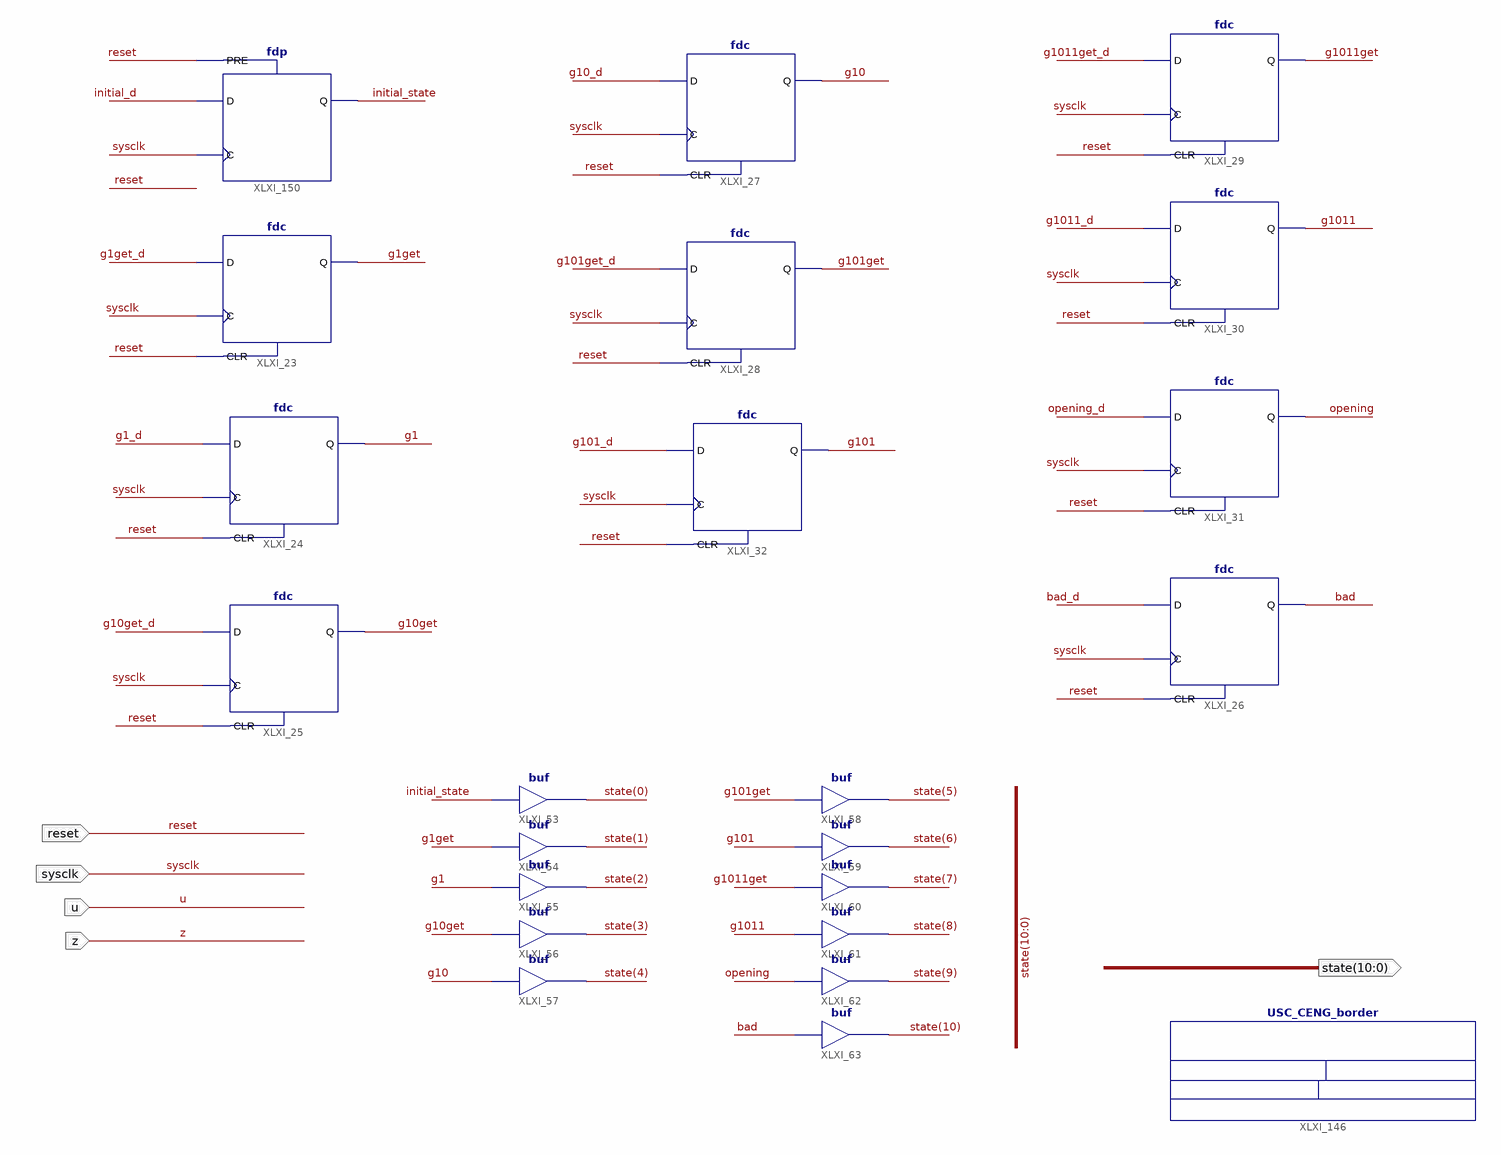
[diagram p0: schematic sheet 1]
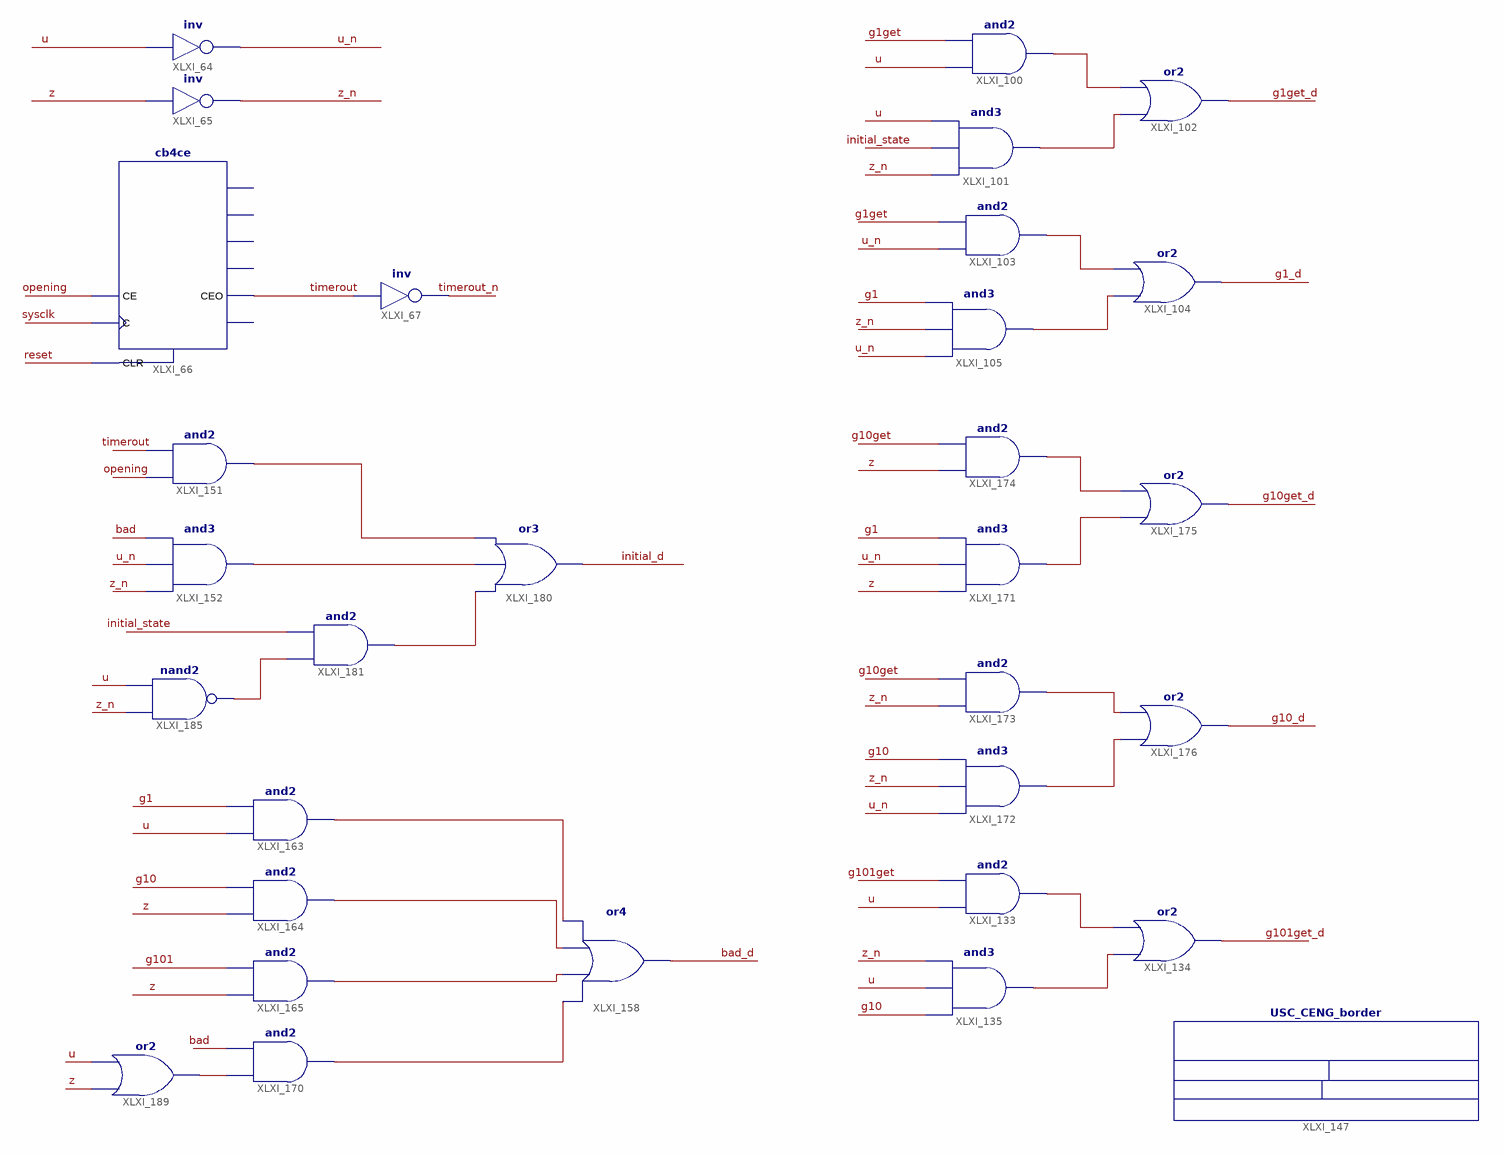
[diagram p1: schematic sheet 2]
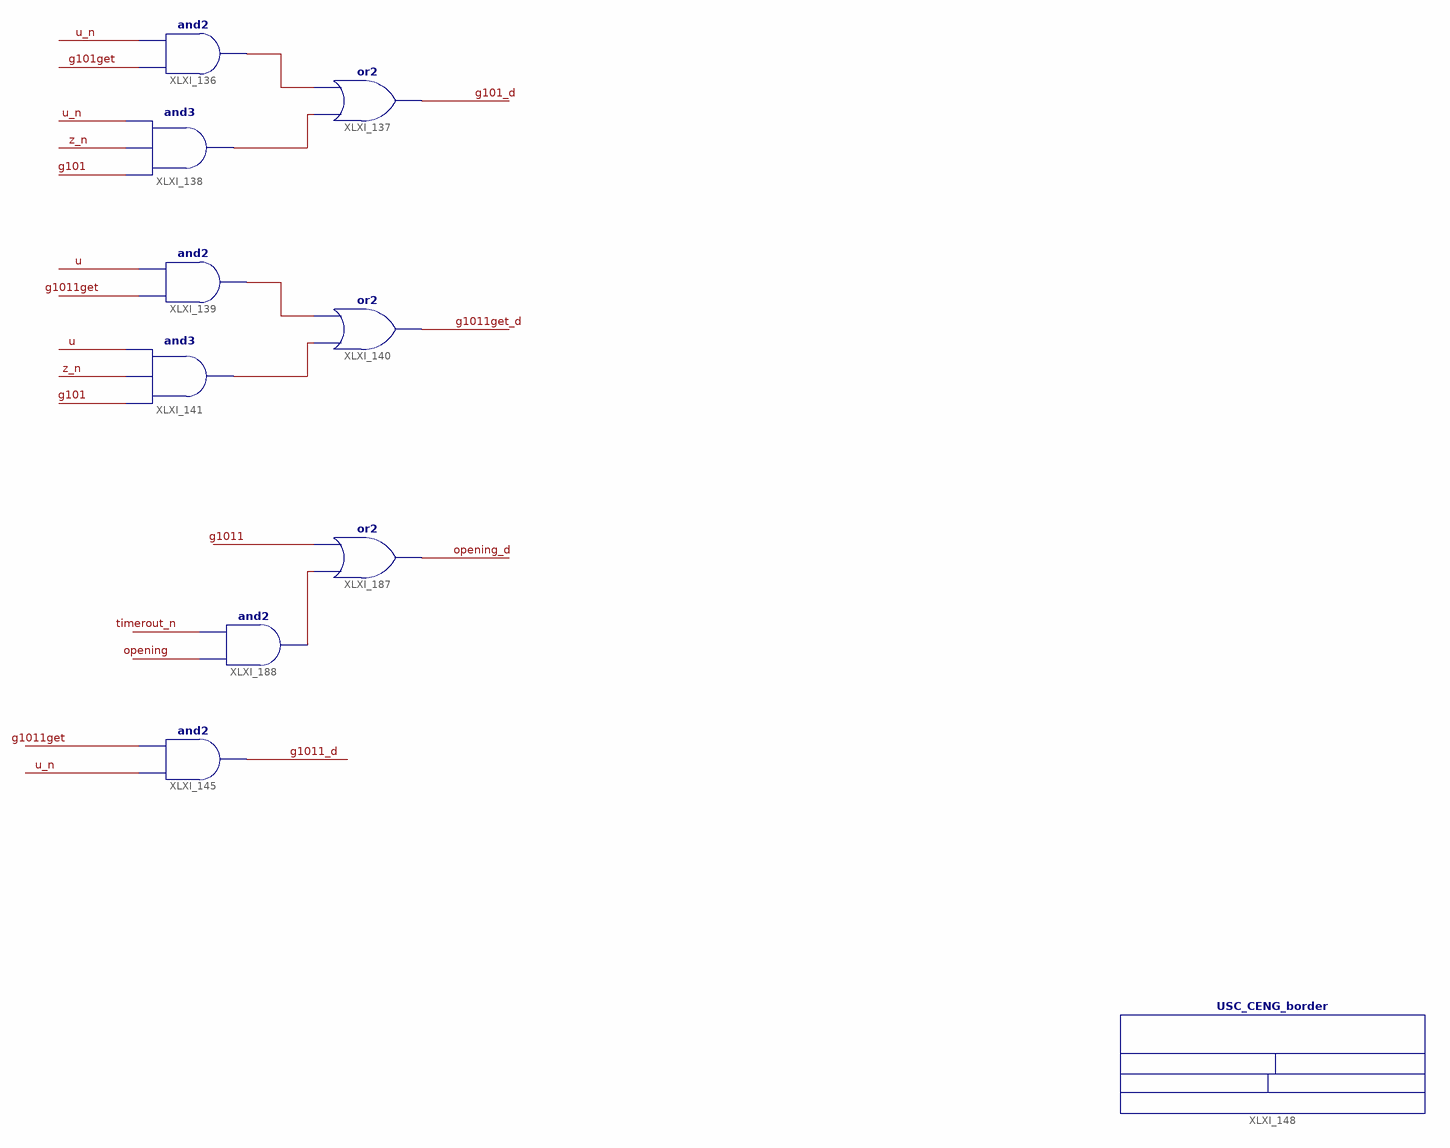
[diagram p2: schematic sheet 3]
// Xilinx ISE schematic ee201l_number_lock.sch (spartan6) as structural Verilog: 64 symbols, 5 ports
module ee201l_number_lock (
  input  sysclk,
  input  reset,
  input  u,
  input  z,
  output [10:0] state
);

  wire bad, bad_d, g1, g1_d, g1get, g1get_d, g10, g10_d, g10get, g10get_d, g101, g101_d, g101get, g101get_d,
       g1011, g1011_d, g1011get, g1011get_d, initial_d, initial_state, opening, opening_d, timerout,
       timerout_n, u_n, XLXN_275, XLXN_276, XLXN_289, XLXN_291, XLXN_379, XLXN_381, XLXN_388, XLXN_390,
       XLXN_397, XLXN_399, XLXN_402, XLXN_403, XLXN_409, XLXN_410, XLXN_411, XLXN_412, XLXN_470, XLXN_474,
       XLXN_475, XLXN_476, XLXN_477, XLXN_494, XLXN_496, XLXN_497, z_n;

  fdc XLXI_23 (.C(sysclk), .CLR(reset), .D(g1get_d), .Q(g1get));
  fdc XLXI_29 (.C(sysclk), .CLR(reset), .D(g1011get_d), .Q(g1011get));
  fdc XLXI_31 (.C(sysclk), .CLR(reset), .D(opening_d), .Q(opening));
  fdc XLXI_26 (.C(sysclk), .CLR(reset), .D(bad_d), .Q(bad));
  fdc XLXI_30 (.C(sysclk), .CLR(reset), .D(g1011_d), .Q(g1011));
  fdc XLXI_27 (.C(sysclk), .CLR(reset), .D(g10_d), .Q(g10));
  fdc XLXI_28 (.C(sysclk), .CLR(reset), .D(g101get_d), .Q(g101get));
  fdc XLXI_32 (.C(sysclk), .CLR(reset), .D(g101_d), .Q(g101));
  fdc XLXI_24 (.C(sysclk), .CLR(reset), .D(g1_d), .Q(g1));
  fdc XLXI_25 (.C(sysclk), .CLR(reset), .D(g10get_d), .Q(g10get));
  not XLXI_64 (u_n, u);
  not XLXI_65 (z_n, z);
  cb4ce XLXI_66 (.C(sysclk), .CE(opening), .CLR(reset), .CEO(timerout));  // open: Q0, Q1, Q2, Q3, TC
  not XLXI_67 (timerout_n, timerout);
  and XLXI_100 (XLXN_275, u, g1get);
  or XLXI_102 (g1get_d, XLXN_276, XLXN_275);
  and XLXI_101 (XLXN_276, z_n, initial_state, u);
  and XLXI_103 (XLXN_289, u_n, g1get);
  or XLXI_104 (g1_d, XLXN_291, XLXN_289);
  and XLXI_105 (XLXN_291, u_n, z_n, g1);
  and XLXI_133 (XLXN_379, u, g101get);
  or XLXI_134 (g101get_d, XLXN_381, XLXN_379);
  and XLXI_135 (XLXN_381, g10, u, z_n);
  and XLXI_136 (XLXN_388, g101get, u_n);
  or XLXI_137 (g101_d, XLXN_390, XLXN_388);
  and XLXI_138 (XLXN_390, g101, z_n, u_n);
  and XLXI_139 (XLXN_397, g1011get, u);
  or XLXI_140 (g1011get_d, XLXN_399, XLXN_397);
  and XLXI_141 (XLXN_399, g101, z_n, u);
  and XLXI_145 (g1011_d, u_n, g1011get);
  USC_CENG_border XLXI_146 ();
  USC_CENG_border XLXI_147 ();
  USC_CENG_border XLXI_148 ();
  buf XLXI_58 (state[5], g101get);
  buf XLXI_59 (state[6], g101);
  buf XLXI_60 (state[7], g1011get);
  buf XLXI_61 (state[8], g1011);
  buf XLXI_62 (state[9], opening);
  buf XLXI_63 (state[10], bad);
  buf XLXI_53 (state[0], initial_state);
  buf XLXI_54 (state[1], g1get);
  buf XLXI_55 (state[2], g1);
  buf XLXI_56 (state[3], g10get);
  buf XLXI_57 (state[4], g10);
  and XLXI_151 (XLXN_403, opening, timerout);
  and XLXI_152 (XLXN_402, z_n, u_n, bad);
  or XLXI_158 (bad_d, XLXN_412, XLXN_411, XLXN_410, XLXN_409);
  and XLXI_163 (XLXN_409, u, g1);
  and XLXI_164 (XLXN_410, z, g10);
  and XLXI_165 (XLXN_411, z, g101);
  and XLXI_170 (XLXN_412, XLXN_470, bad);
  and XLXI_171 (XLXN_475, z, u_n, g1);
  and XLXI_172 (XLXN_477, u_n, z_n, g10);
  and XLXI_173 (XLXN_476, z_n, g10get);
  and XLXI_174 (XLXN_474, z, g10get);
  or XLXI_175 (g10get_d, XLXN_475, XLXN_474);
  or XLXI_176 (g10_d, XLXN_477, XLXN_476);
  fdp XLXI_150 (.C(sysclk), .D(initial_d), .PRE(reset), .Q(initial_state));
  or XLXI_180 (initial_d, XLXN_496, XLXN_402, XLXN_403);
  and XLXI_181 (XLXN_496, XLXN_494, initial_state);
  nand XLXI_185 (XLXN_494, z_n, u);
  or XLXI_187 (opening_d, XLXN_497, g1011);
  and XLXI_188 (XLXN_497, opening, timerout_n);
  or XLXI_189 (XLXN_470, z, u);
endmodule
